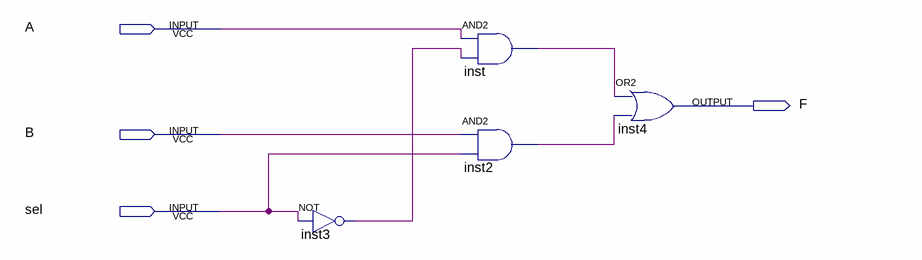
[diagram p0: schematic sheet]
// Quartus schematic Mux1bit.bdf as structural Verilog: 4 symbols, 4 pins
module Mux1bit (
  input  A,
  input  B,
  input  sel,
  output F
);

  wire inst2_out, inst3_out, inst_out;

  not inst3 (inst3_out, sel);
  and inst (inst_out, A, inst3_out);
  and inst2 (inst2_out, B, sel);
  or inst4 (F, inst_out, inst2_out);
endmodule
